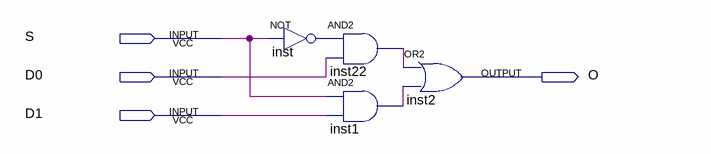
[diagram p0: schematic sheet]
// Quartus schematic Mux_2to1.bdf as structural Verilog: 4 symbols, 4 pins
module Mux_2to1 (
  input  S,
  input  D0,
  input  D1,
  output O
);

  wire inst1_out, inst22_out, inst_out;

  not inst (inst_out, S);
  and inst22 (inst22_out, inst_out, D0);
  and inst1 (inst1_out, S, D1);
  or inst2 (O, inst22_out, inst1_out);
endmodule
